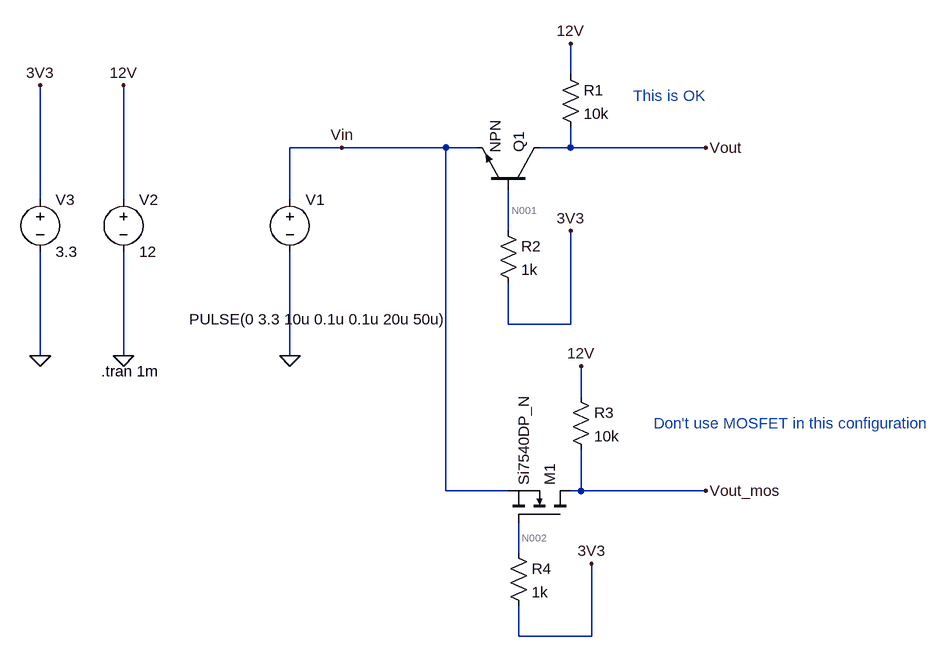
[diagram p0: schematic Noninverting_level_shift.asc]
Noninverting_level_shift.asc, the LTspice schematic file:
Version 4
SHEET 1 880 900
WIRE 272 32 272 -16
WIRE -80 144 -160 144
WIRE 80 144 -80 144
WIRE 128 144 80 144
WIRE 272 144 272 112
WIRE 272 144 224 144
WIRE 480 144 272 144
WIRE -544 224 -544 48
WIRE -416 224 -416 48
WIRE -160 224 -160 144
WIRE 176 272 176 208
WIRE 176 416 176 352
WIRE 272 416 272 272
WIRE 272 416 176 416
WIRE -544 464 -544 304
WIRE -416 464 -416 304
WIRE -160 464 -160 304
WIRE 288 528 288 480
WIRE 80 672 80 144
WIRE 176 672 80 672
WIRE 288 672 288 608
WIRE 288 672 272 672
WIRE 480 672 288 672
WIRE 192 768 192 720
WIRE 192 896 192 848
WIRE 304 896 304 784
WIRE 304 896 192 896
FLAG -160 464 0
FLAG -416 464 0
FLAG -416 48 12V
FLAG 272 -16 12V
FLAG 480 144 Vout
FLAG -80 144 Vin
FLAG -544 464 0
FLAG -544 48 3V3
FLAG 272 272 3V3
FLAG 288 480 12V
FLAG 304 784 3V3
FLAG 480 672 Vout_mos
SYMBOL npn 224 208 M270
SYMATTR InstName Q1
SYMBOL voltage -160 208 R0
WINDOW 3 -155 200 Left 2
WINDOW 123 0 0 Left 2
WINDOW 39 0 0 Left 2
SYMATTR InstName V1
SYMATTR Value PULSE(0 3.3 10u 0.1u 0.1u 20u 50u)
SYMBOL voltage -416 208 R0
SYMATTR InstName V2
SYMATTR Value 12
SYMBOL res 256 16 R0
SYMATTR InstName R1
SYMATTR Value 10k
SYMBOL res 160 256 R0
SYMATTR InstName R2
SYMATTR Value 1k
SYMBOL voltage -544 208 R0
SYMATTR InstName V3
SYMATTR Value 3.3
SYMBOL nmos 272 720 M270
SYMATTR InstName M1
SYMATTR Value Si7540DP_N
SYMBOL res 272 512 R0
SYMATTR InstName R3
SYMATTR Value 10k
SYMBOL res 176 752 R0
SYMATTR InstName R4
SYMATTR Value 1k
TEXT -450 488 Left 2 !.tran 1m
TEXT 400 568 Left 2 ;Don't use MOSFET in this configuration
TEXT 368 64 Left 2 ;This is OK

The netlist it stands for:
* Noninverting_level_shift.asc
Q1 Vout N001 Vin 0 NPN
V1 Vin 0 PULSE(0 3.3 10u 0.1u 0.1u 20u 50u)
V2 12V 0 12
R1 12V Vout 10k
R2 N001 3V3 1k
V3 3V3 0 3.3
M1 Vout_mos N002 Vin Vin Si7540DP_N
R3 12V Vout_mos 10k
R4 N002 3V3 1k
.model NPN NPN
.model PNP PNP
.lib standard.bjt
.model NMOS NMOS
.model PMOS PMOS
.lib standard.mos
.tran 1m
* Don't use MOSFET in this configuration
* This is OK
.backanno
.end

* Results of the author's LTspice run, read from the files saved beside the schematic
* Operating Point, zero values left out:
*   V(vout) = 23.65 mV
*   V(n001) = 820.7 mV
*   V(12v) = 12 V
*   V(3v3) = 3.3 V
*   V(vout_mos) = 25.82 µV
*   V(n002) = 3.3 V
*   Ic(Q1) = 1.198 mA
*   Ib(Q1) = 2.479 mA
*   Ie(Q1) = -3.677 mA
*   Id(M1) = 1.2 mA
*   Is(M1) = -1.2 mA
*   I(R3) = 1.2 mA
*   I(R2) = -2.479 mA
*   I(R1) = 1.198 mA
*   I(V3) = -2.479 mA
*   I(V2) = -2.398 mA
*   I(V1) = 4.877 mA
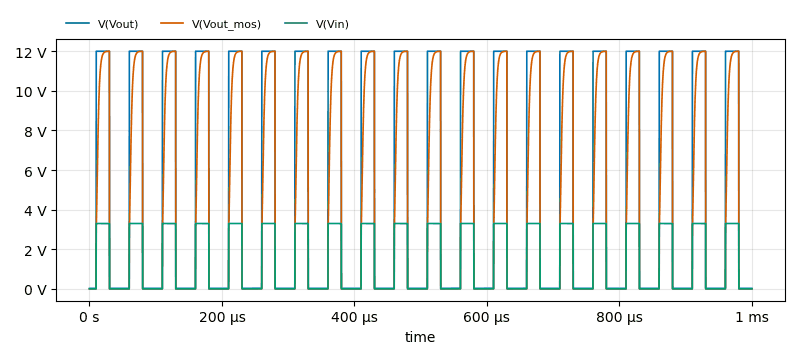
[diagram p1: Transient Analysis of Noninverting_level_shift.asc, plotted from the saved traces]
* Transient Analysis, 1 run:
*   V(Vout): min 23.65 mV, max 12 V, average 4.829 V, rms 7.598 V, last 23.65 mV
*   V(Vout_mos): min 25.75 µV, max 12 V, average 4.241 V, rms 6.861 V, last 25.82 µV
*   V(Vin): min 0 V, max 3.3 V, average 1.327 V, rms 2.091 V, last 0 V